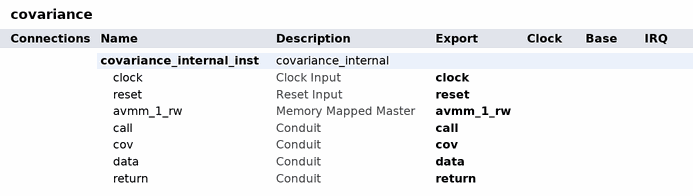
[diagram p0: system contents]
# Platform Designer (Qsys) system covariance, Cyclone V 5CSEMA4U23C7
# Parameters at their usual value, and those the tool derives, are not listed.
package require qsys
create_system covariance
set_project_property DEVICE_FAMILY {Cyclone V}
set_project_property DEVICE 5CSEMA4U23C7

add_instance covariance_internal_inst covariance_internal 1.0
set_instance_property covariance_internal_inst AUTO_EXPORT true

# exported interfaces
add_interface avmm_1_rw avalon master
set_interface_property avmm_1_rw EXPORT_OF covariance_internal_inst.avmm_1_rw
add_interface call conduit end
set_interface_property call EXPORT_OF covariance_internal_inst.call
add_interface clock clock sink
set_interface_property clock EXPORT_OF covariance_internal_inst.clock
add_interface cov conduit end
set_interface_property cov EXPORT_OF covariance_internal_inst.cov
add_interface data conduit end
set_interface_property data EXPORT_OF covariance_internal_inst.data
add_interface reset reset sink
set_interface_property reset EXPORT_OF covariance_internal_inst.reset
add_interface return conduit end
set_interface_property return EXPORT_OF covariance_internal_inst.return

set_interconnect_requirement {$system} qsys_mm.clockCrossingAdapter HANDSHAKE
set_interconnect_requirement {$system} qsys_mm.enableEccProtection FALSE
set_interconnect_requirement {$system} qsys_mm.insertDefaultSlave FALSE
set_interconnect_requirement {$system} qsys_mm.maxAdditionalLatency 1

save_system covariance.qsys
